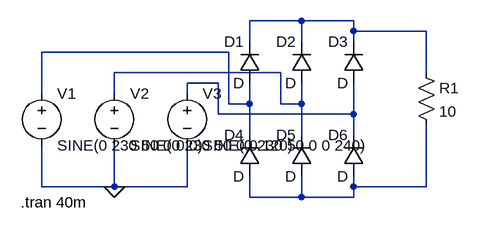
[diagram p0: schematic 3_phase_Full_wave.asc]
3_phase_Full_wave.asc, the LTspice schematic file:
Version 4
SHEET 1 880 680
WIRE 192 48 112 48
WIRE 272 48 192 48
WIRE 272 64 272 48
WIRE 384 64 272 64
WIRE 112 80 112 48
WIRE 192 80 192 48
WIRE 272 80 272 64
WIRE 80 96 -208 96
WIRE 160 128 -96 128
WIRE 384 128 384 64
WIRE 64 144 16 144
WIRE -208 160 -208 96
WIRE -96 160 -96 128
WIRE 16 160 16 144
WIRE 80 176 80 96
WIRE 112 176 112 144
WIRE 112 176 80 176
WIRE 160 176 160 128
WIRE 192 176 192 144
WIRE 192 176 160 176
WIRE 64 192 64 144
WIRE 272 192 272 144
WIRE 272 192 64 192
WIRE 112 224 112 176
WIRE 192 224 192 176
WIRE 272 224 272 192
WIRE -208 304 -208 240
WIRE -96 304 -96 240
WIRE -96 304 -208 304
WIRE 16 304 16 240
WIRE 16 304 -96 304
WIRE 272 304 272 288
WIRE 384 304 384 208
WIRE 384 304 272 304
WIRE 112 320 112 288
WIRE 192 320 192 288
WIRE 192 320 112 320
WIRE 272 320 272 304
WIRE 272 320 192 320
FLAG -96 304 0
SYMBOL diode 128 144 R180
WINDOW 0 24 64 Left 2
WINDOW 3 24 0 Left 2
SYMATTR InstName D1
SYMBOL diode 208 144 R180
WINDOW 0 24 64 Left 2
WINDOW 3 24 0 Left 2
SYMATTR InstName D2
SYMBOL diode 288 144 R180
WINDOW 0 24 64 Left 2
WINDOW 3 24 0 Left 2
SYMATTR InstName D3
SYMBOL diode 128 288 R180
WINDOW 0 24 64 Left 2
WINDOW 3 24 0 Left 2
SYMATTR InstName D4
SYMBOL diode 208 288 R180
WINDOW 0 24 64 Left 2
WINDOW 3 24 0 Left 2
SYMATTR InstName D5
SYMBOL diode 288 288 R180
WINDOW 0 24 64 Left 2
WINDOW 3 24 0 Left 2
SYMATTR InstName D6
SYMBOL res 368 112 R0
SYMATTR InstName R1
SYMATTR Value 10
SYMBOL voltage -208 144 R0
WINDOW 123 0 0 Left 0
WINDOW 39 0 0 Left 0
SYMATTR InstName V1
SYMATTR Value SINE(0 230 50 0 0 0)
SYMBOL voltage -96 144 R0
WINDOW 123 0 0 Left 0
WINDOW 39 0 0 Left 0
SYMATTR InstName V2
SYMATTR Value SINE(0 230 50 0 0 120)
SYMBOL voltage 16 144 R0
WINDOW 123 0 0 Left 0
WINDOW 39 0 0 Left 0
SYMATTR InstName V3
SYMATTR Value SINE(0 230 50 0 0 240)
TEXT -240 328 Left 2 !.tran 40m

The netlist it stands for:
* 3_phase_Full_wave.asc
D1 N002 N001 D
D2 N003 N001 D
D3 N004 N001 D
D4 N005 N002 D
D5 N005 N003 D
D6 N005 N004 D
R1 N001 N005 10
V1 N002 0 SINE(0 230 50 0 0 0)
V2 N003 0 SINE(0 230 50 0 0 120)
V3 N004 0 SINE(0 230 50 0 0 240)
.model D D
.lib standard.dio
.tran 40m
.backanno
.end